# EAGLE design counter-defender-esp8266-pir-mk-1.1 (EAGLE 7.5.0)
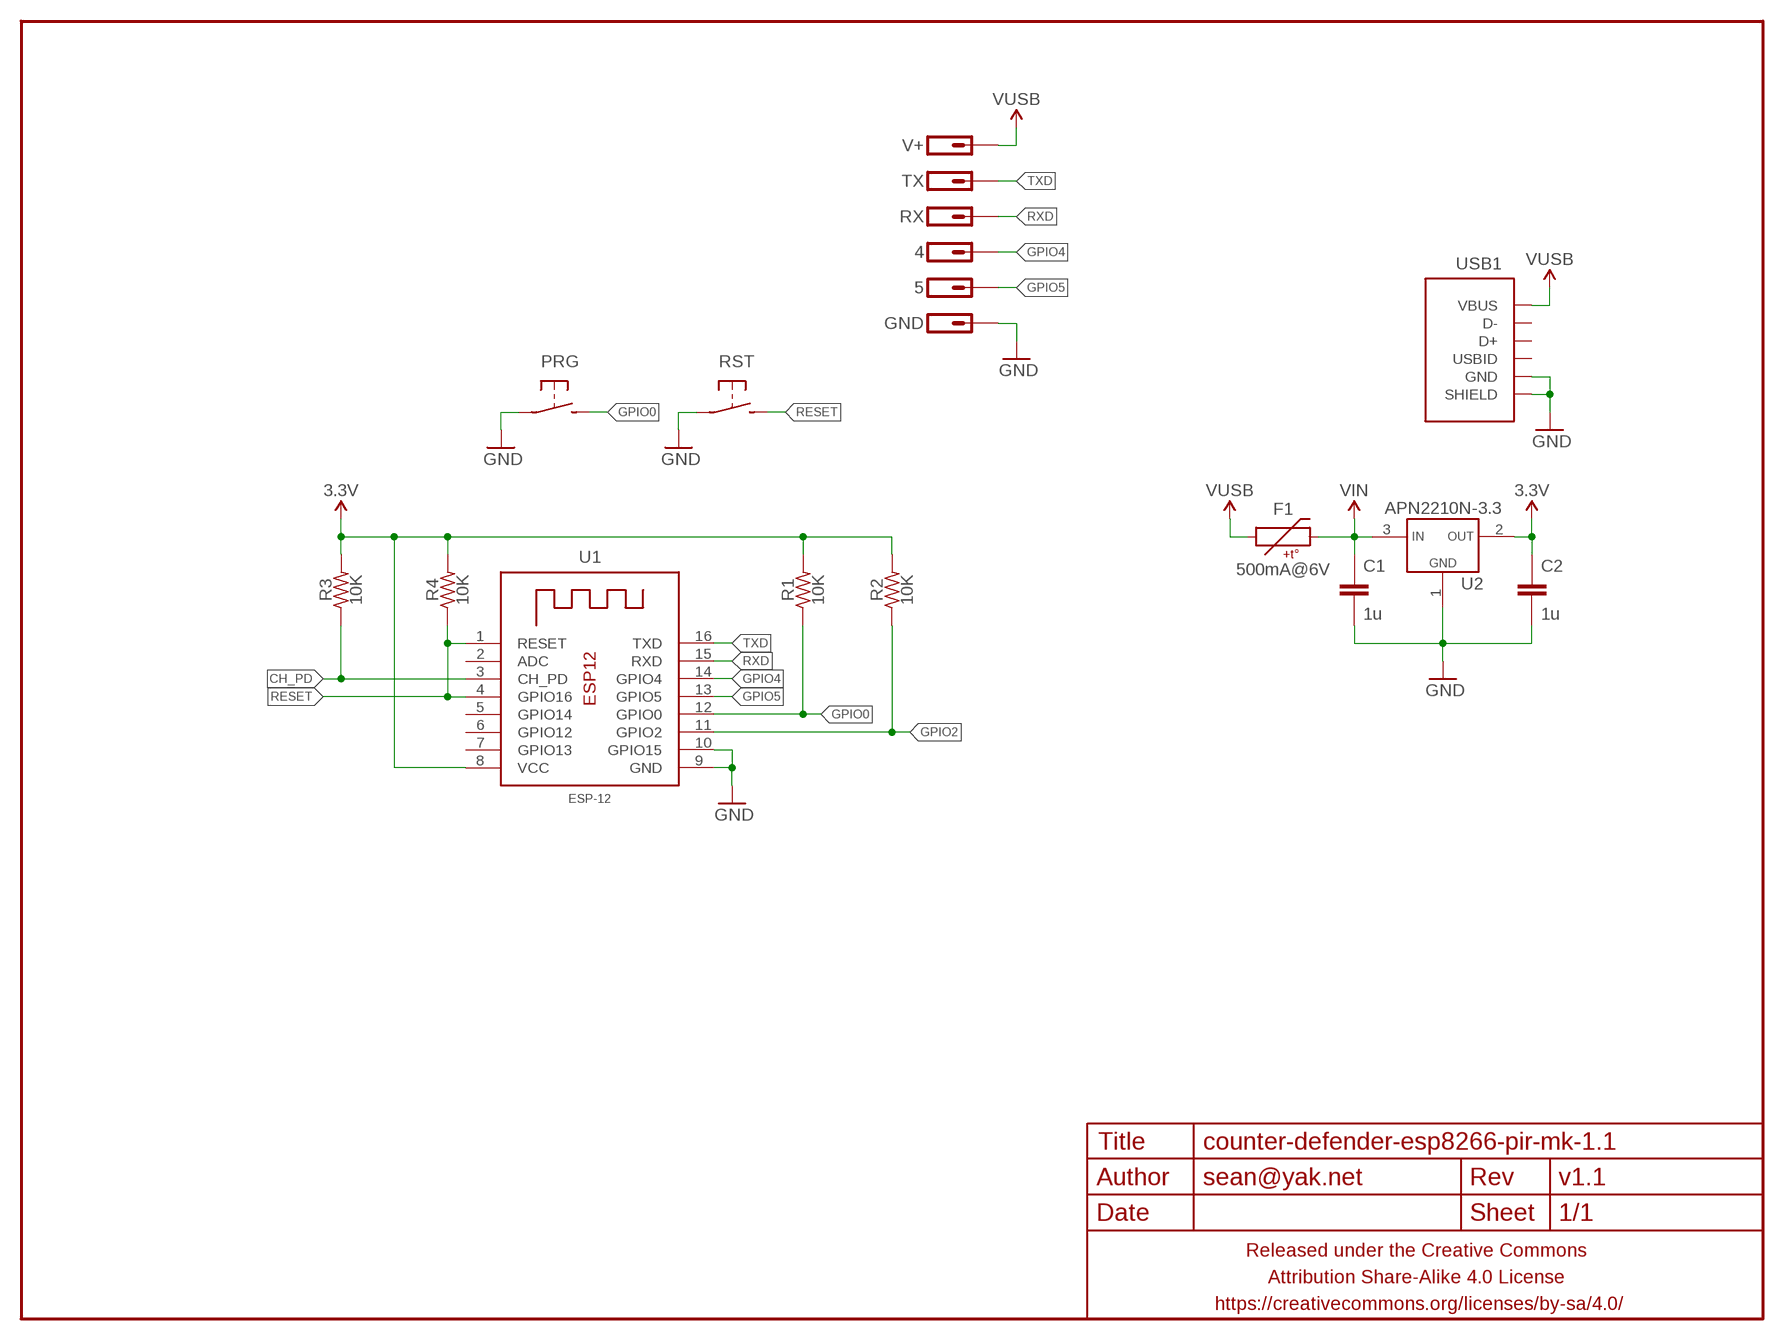
[diagram p0: schematic, sheet 1]

## Parts
4  M01PTH  [1X01]
5  M01PTH  [1X01]
C1  1u  CAPACITOR-CERAMICC0603-TIGHTER  [C0603-TIGHTER]
C2  1u  CAPACITOR-CERAMICC0603-TIGHTER  [C0603-TIGHTER]
F1  500mA@6V  PTC0603  [0603]
FRAME1  FRAME-LETTERNO_PACKAGE  [DUMMY]
GND  M01PTH  [1X01]
PRG  SPST-NO-TACTSMD-TINIER  [TACTILE_SWITCH_SMD_TINY]
R1  10K  RESISTORR0603-TIGHTER  [R0603-TIGHTER]
R2  10K  RESISTORR0603-TIGHTER  [R0603-TIGHTER]
R3  10K  RESISTORR0603-TIGHTER  [R0603-TIGHTER]
R4  10K  RESISTORR0603-TIGHTER  [R0603-TIGHTER]
RST  SPST-NO-TACTSMD-TINIER  [TACTILE_SWITCH_SMD_TINY]
RX  M01PTH  [1X01]
TX  M01PTH  [1X01]
U1  ESP-12  [ESP-12]
U2  APN2210N-3.3  VREG_1117SOT-23  [SOT23]
USB1  USB-AB-SHIELDFCI-10103594-USB-MICRO-B-EVENLESSER  [FCI-10103594-USB-MICRO-B-EVENLESSER]
V+  M01PTH  [1X01]

## Nets
3.3V: C2.1 R1.2 R2.2 R3.2 R4.2 U1.8(VCC) U2.2(VOUT)
CH_PD: R3.1 U1.3(CH_PD)
GND: C1.2 C2.2 GND.1 PRG.P$1 RST.P$1 U1.9(GND) U1.10(GPIO15) U2.1(GND) USB1.5(GND) USB1.SHIELD@1(SHIELD) USB1.SHIELD@2(SHIELD) USB1.SHIELD@3(SHIELD) USB1.SHIELD@4(SHIELD) USB1.SHIELD@5(SHIELD) USB1.SHIELD@6(SHIELD)
GPIO0: PRG.P$2 R1.1 U1.12(GPIO0)
GPIO2: R2.1 U1.11(GPIO2)
GPIO4: 4.1 U1.14(GPIO4)
GPIO5: 5.1 U1.13(GPIO5)
RESET: R4.1 RST.P$2 U1.1(RESET) U1.4(GPIO16)
RXD: RX.1 U1.15(RXD)
TXD: TX.1 U1.16(TXD)
VIN: C1.1 F1.2 U2.3(VIN)
VUSB: F1.1 USB1.1(VBUS) V+.1
Unconnected: U1.2(ADC) U1.5(GPIO14) U1.6(GPIO12) U1.7(GPIO13) USB1.2(D-) USB1.3(D+) USB1.4(USBID)

## Library data of the parts
4 5 GND RX TX V+ = a_parts:M01: Header 1 Standard 1-pin 0.1" header. Use with straight break away headers (SKU : PRT-00116), right angle break away headers (PRT-00553), swiss pins (PRT-00743), machine pins (PRT-00117), and female headers (PRT-00115).
C1 C2 = a_parts:CAPACITOR-CERAMIC: CAPACITOR, European symbol
F1 = a_parts:PTC: Resettable Fuse PTC Resettable Fuse. Spark Fun Electronics SKU : COM-08357
FRAME1 = a_parts:FRAME-LETTER: Schematic Frame Standard 8.5x11 US Letter frame; DESIGNER: sean@yak.net; VERSION: v1.1
PRG RST = a_parts:SPST-NO-TACT
R1-R4 = a_parts:RESISTOR: RESISTOR, American symbol
U1 = a_parts:ESP-12
U2 = a_parts:VREG_1117
USB1 = a_parts:USB-AB-SHIELD

## Board
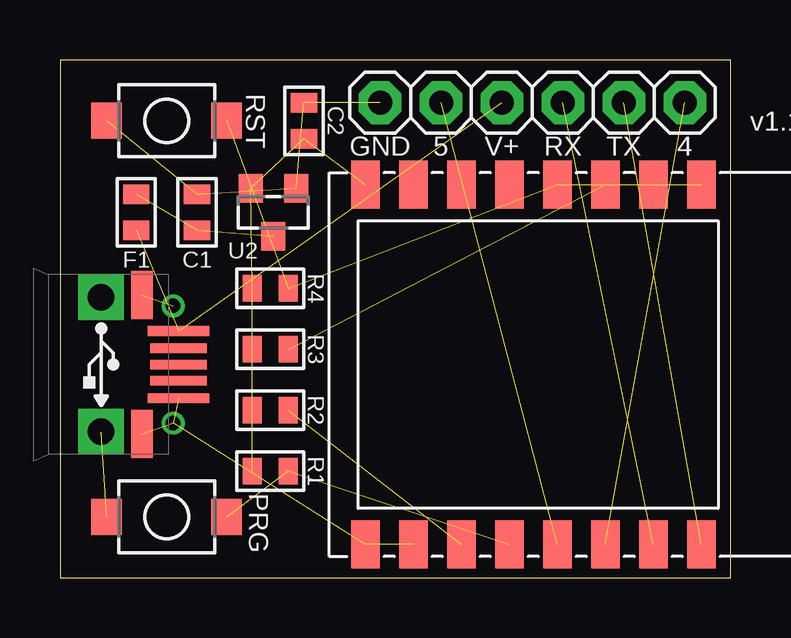
[diagram p1: board, top side]
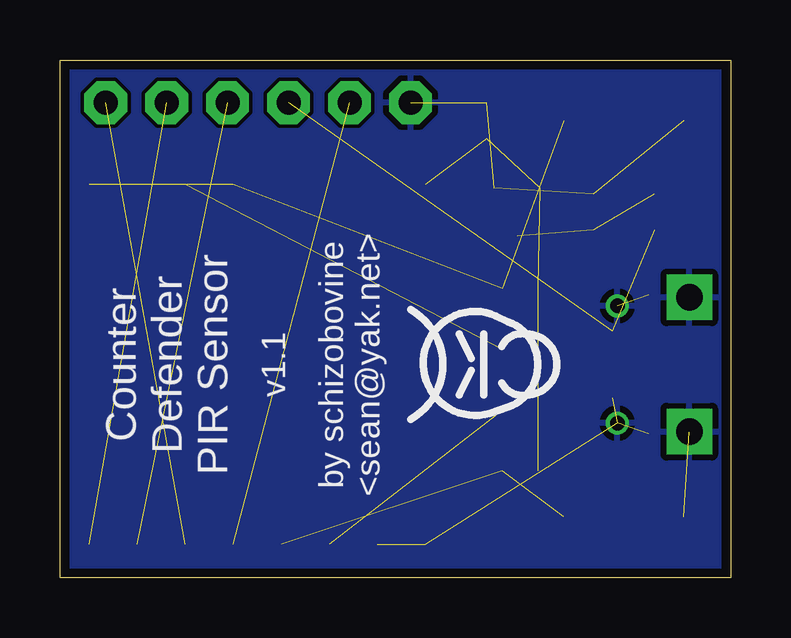
[diagram p2: board, bottom side, seen from below]

Size 27.94 x 21.59 mm. Coordinates in mm from the lower left corner, seen from the top.
Outline: 0,21.59 0,0 27.94,0 27.94,21.59 0,21.59
Copper layers (1*16): Top 0.0356mm / dielectric 1.5011mm / Bottom 0.0356mm
Design rules "LaenPCBOrder2": minimum track width 6mil, minimum drill 13mil, track to track 6mil, track to pad 6mil, pad to pad 6mil, via to via 6mil, smd to smd 6mil, copper to edge 15mil, drill to drill 6mil, minimum pad ring 7mil, minimum via ring 7mil, stop-mask expansion 3mil, vias tented up to drill 20mil, thermal gap 10mil

### Footprints (pad centres in the part's own frame; a part is rotated, then mirrored left to right if it is on the bottom)
1X01 = drill 1 pad 1.778 octagon: 1 0,0
C0603-TIGHTER = smd 0.8 x 1.1: 1 -0.75,0; 2 0.75,0
0603 = smd 0.8 x 1.1: 1 -0.75,0; 2 0.75,0
TACTILE_SWITCH_SMD_TINY = smd 1.27 x 1.5: P$1 -2.5,0; P$2 2.5,0
R0603-TIGHTER = smd 0.8 x 1.1: 1 -0.75,0; 2 0.75,0
ESP-12 = smd 2 x 1.2: 1 -7.5,4.5; 2 -7.5,2.5; 3 -7.5,0.5; 4 -7.5,-1.5; 5 -7.5,-3.5; 6 -7.5,-5.5; 7 -7.5,-7.5; 8 -7.5,-9.5; 9 7.5,-9.5; 10 7.5,-7.5; 11 7.5,-5.5; 12 7.5,-3.5; 13 7.5,-1.5; 14 7.5,0.5; 15 7.5,2.5; 16 7.5,4.5
SOT23 = smd 1 x 1.2: 1 -0.95,-1; 2 0.95,-1; 3 0,1
FCI-10103594-USB-MICRO-B-EVENLESSER = smd 0.4 x 2.55: 1 -1.4,3.225; 5 1.4,3.225 | smd 0.4 x 2.35: 2 -0.675,3.225; 3 0,3.225; 4 0.675,3.225 | drill 0.6 pad 0.9: SHIELD@1 -2.445,3; SHIELD@2 2.445,3 | drill 1.1 pad 1.9 square: SHIELD@3 -2.8,0; SHIELD@4 2.8,0 | smd 2 x 0.9: SHIELD@5 -2.9,1.7; SHIELD@6 2.9,1.7

### Placement (x,y rotation side)
4  26.04,19.81 180 top
5  15.88,19.81 180 top
C1  5.71,15.24 90 top
C2  10.16,19.05 90 top
F1  3.17,15.24 90 top
FRAME1  0,0 0 top
GND  13.34,19.81 180 top
PRG  4.45,2.54 0 top
R1  8.76,4.45 180 top
R2  8.76,6.99 180 top
R3  8.76,9.53 180 top
R4  8.76,12.06 180 top
RST  4.45,19.05 0 top
RX  20.95,19.81 180 top
TX  23.5,19.81 180 top
U1  22.23,8.89 270 top
U2  8.89,15.24 180 top
U$2  [COW_SMALL_NOTEXT]  10.79,8.89 90 bottom
USB1  1.71,8.89 270 top
V+  18.41,19.81 180 top

### Tracks (layer width: path | path; a pad name or v marks a point on that pad's centre or on a via)
3.3V  (6 unrouted)
CH_PD  (1 unrouted)
GND  (10 unrouted)
  pour Bottom (rank 6): 0,21.59 0,0 27.94,0 27.94,21.59
GPIO0  (2 unrouted)
GPIO2  (1 unrouted)
GPIO4  (1 unrouted)
GPIO5  (1 unrouted)
RESET  (3 unrouted)
RXD  (1 unrouted)
TXD  (1 unrouted)
VIN  (2 unrouted)
VUSB  (2 unrouted)

### Text on the board
bPlace: by schizobovine / <sean@yak.net> | Counter / Defender / PIR Sensor